# Altium schematic sheet A7_MGT.SchDoc
size A3
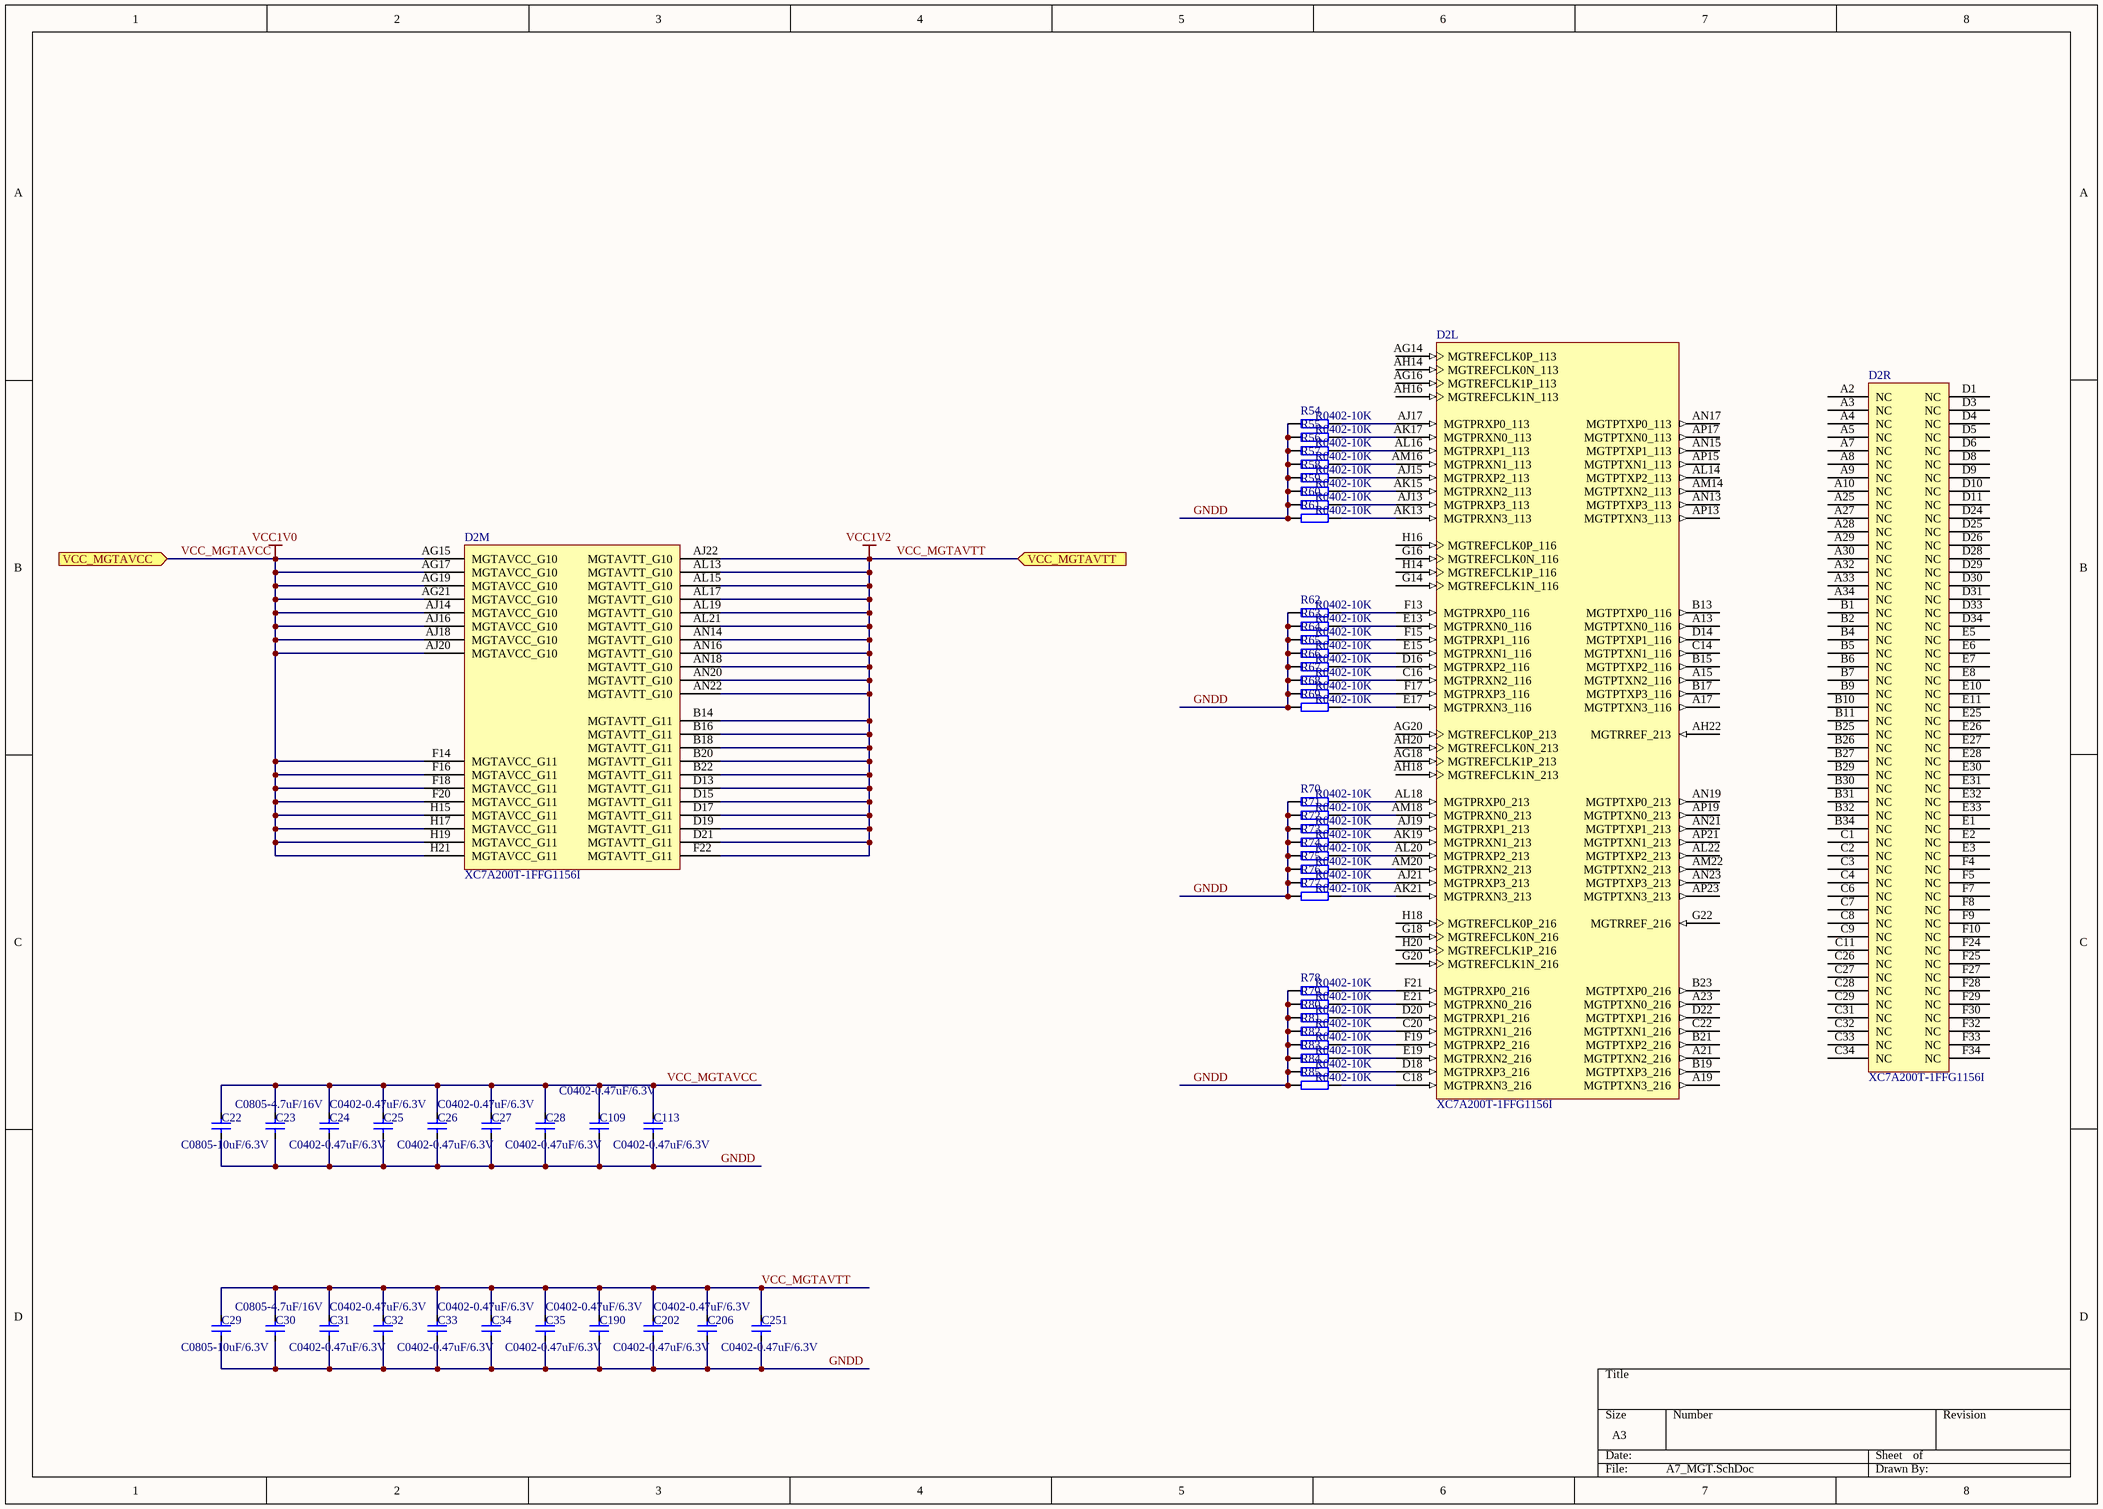
[diagram p0: A7_MGT.SchDoc]

## Parts
C22  C0805-10uF/6.3V  [C0805]
C23  C0805-4.7uF/16V  [C0805]
C24  C0402-0.47uF/6.3V  [C0402]
C25  C0402-0.47uF/6.3V  [C0402]
C26  C0402-0.47uF/6.3V  [C0402]
C27  C0402-0.47uF/6.3V  [C0402]
C28  C0402-0.47uF/6.3V  [C0402]
C29  C0805-10uF/6.3V  [C0805]
C30  C0805-4.7uF/16V  [C0805]
C31  C0402-0.47uF/6.3V  [C0402]
C32  C0402-0.47uF/6.3V  [C0402]
C33  C0402-0.47uF/6.3V  [C0402]
C34  C0402-0.47uF/6.3V  [C0402]
C35  C0402-0.47uF/6.3V  [C0402]
C109  C0402-0.47uF/6.3V  [C0402]
C113  C0402-0.47uF/6.3V  [C0402]
C190  C0402-0.47uF/6.3V  [C0402]
C202  C0402-0.47uF/6.3V  [C0402]
C206  C0402-0.47uF/6.3V  [C0402]
C251  C0402-0.47uF/6.3V  [C0402]
D2  XC7A200T-1FFG1156I  [FFG1156]  (parts L,M,R of 18)
R54  R0402-10K  [R0402]
R55  R0402-10K  [R0402]
R56  R0402-10K  [R0402]
R57  R0402-10K  [R0402]
R58  R0402-10K  [R0402]
R59  R0402-10K  [R0402]
R60  R0402-10K  [R0402]
R61  R0402-10K  [R0402]
R62  R0402-10K  [R0402]
R63  R0402-10K  [R0402]
R64  R0402-10K  [R0402]
R65  R0402-10K  [R0402]
R66  R0402-10K  [R0402]
R67  R0402-10K  [R0402]
R68  R0402-10K  [R0402]
R69  R0402-10K  [R0402]
R70  R0402-10K  [R0402]
R71  R0402-10K  [R0402]
R72  R0402-10K  [R0402]
R73  R0402-10K  [R0402]
R74  R0402-10K  [R0402]
R75  R0402-10K  [R0402]
R76  R0402-10K  [R0402]
R77  R0402-10K  [R0402]
R78  R0402-10K  [R0402]
R79  R0402-10K  [R0402]
R80  R0402-10K  [R0402]
R81  R0402-10K  [R0402]
R82  R0402-10K  [R0402]
R83  R0402-10K  [R0402]
R84  R0402-10K  [R0402]
R85  R0402-10K  [R0402]

## Ports
VCC_MGTAVCC (in), VCC_MGTAVTT (in)

## Nets
VCC_MGTAVCC: C22.1 C23.1 C24.1 C25.1 C26.1 C27.1 C28.1 C109.1 C113.1 D2.AG15(MGTAVCC_G10) D2.AG17(MGTAVCC_G10) D2.AG19(MGTAVCC_G10) D2.AG21(MGTAVCC_G10) D2.AJ14(MGTAVCC_G10) D2.AJ16(MGTAVCC_G10) D2.AJ18(MGTAVCC_G10) D2.AJ20(MGTAVCC_G10) D2.F14(MGTAVCC_G11) D2.F16(MGTAVCC_G11) D2.F18(MGTAVCC_G11) D2.F20(MGTAVCC_G11) D2.H15(MGTAVCC_G11) D2.H17(MGTAVCC_G11) D2.H19(MGTAVCC_G11) D2.H21(MGTAVCC_G11) ; port VCC_MGTAVCC  [also labelled VCC1V0]
VCC_MGTAVTT: C29.1 C30.1 C31.1 C32.1 C33.1 C34.1 C35.1 C190.1 C202.1 C206.1 C251.1 D2.AJ22(MGTAVTT_G10) D2.AL13(MGTAVTT_G10) D2.AL15(MGTAVTT_G10) D2.AL17(MGTAVTT_G10) D2.AL19(MGTAVTT_G10) D2.AL21(MGTAVTT_G10) D2.AN14(MGTAVTT_G10) D2.AN16(MGTAVTT_G10) D2.AN18(MGTAVTT_G10) D2.AN20(MGTAVTT_G10) D2.AN22(MGTAVTT_G10) D2.B14(MGTAVTT_G11) D2.B16(MGTAVTT_G11) D2.B18(MGTAVTT_G11) D2.B20(MGTAVTT_G11) D2.B22(MGTAVTT_G11) D2.D13(MGTAVTT_G11) D2.D15(MGTAVTT_G11) D2.D17(MGTAVTT_G11) D2.D19(MGTAVTT_G11) D2.D21(MGTAVTT_G11) D2.F22(MGTAVTT_G11) ; port VCC_MGTAVTT  [also labelled VCC1V2]
GNDD: C22.2 C23.2 C24.2 C25.2 C26.2 C27.2 C28.2 C29.2 C30.2 C31.2 C32.2 C33.2 C34.2 C35.2 C109.2 C113.2 C190.2 C202.2 C206.2 C251.2 R54.1 R55.1 R56.1 R57.1 R58.1 R59.1 R60.1 R61.1 R62.1 R63.1 R64.1 R65.1 R66.1 R67.1 R68.1 R69.1 R70.1 R71.1 R72.1 R73.1 R74.1 R75.1 R76.1 R77.1 R78.1 R79.1 R80.1 R81.1 R82.1 R83.1 R84.1 R85.1
NetD2_AJ13: D2.AJ13(MGTPRXP3_113) R60.2
NetD2_AJ15: D2.AJ15(MGTPRXP2_113) R58.2
NetD2_AJ17: D2.AJ17(MGTPRXP0_113) R54.2
NetD2_AJ19: D2.AJ19(MGTPRXP1_213) R72.2
NetD2_AJ21: D2.AJ21(MGTPRXP3_213) R76.2
NetD2_AK13: D2.AK13(MGTPRXN3_113) R61.2
NetD2_AK15: D2.AK15(MGTPRXN2_113) R59.2
NetD2_AK17: D2.AK17(MGTPRXN0_113) R55.2
NetD2_AK19: D2.AK19(MGTPRXN1_213) R73.2
NetD2_AK21: D2.AK21(MGTPRXN3_213) R77.2
NetD2_AL16: D2.AL16(MGTPRXP1_113) R56.2
NetD2_AL18: D2.AL18(MGTPRXP0_213) R70.2
NetD2_AL20: D2.AL20(MGTPRXP2_213) R74.2
NetD2_AM16: D2.AM16(MGTPRXN1_113) R57.2
NetD2_AM18: D2.AM18(MGTPRXN0_213) R71.2
NetD2_AM20: D2.AM20(MGTPRXN2_213) R75.2
NetD2_C16: D2.C16(MGTPRXN2_116) R67.2
NetD2_C18: D2.C18(MGTPRXN3_216) R85.2
NetD2_C20: D2.C20(MGTPRXN1_216) R81.2
NetD2_D16: D2.D16(MGTPRXP2_116) R66.2
NetD2_D18: D2.D18(MGTPRXP3_216) R84.2
NetD2_D20: D2.D20(MGTPRXP1_216) R80.2
NetD2_E13: D2.E13(MGTPRXN0_116) R63.2
NetD2_E15: D2.E15(MGTPRXN1_116) R65.2
NetD2_E17: D2.E17(MGTPRXN3_116) R69.2
NetD2_E19: D2.E19(MGTPRXN2_216) R83.2
NetD2_E21: D2.E21(MGTPRXN0_216) R79.2
NetD2_F13: D2.F13(MGTPRXP0_116) R62.2
NetD2_F15: D2.F15(MGTPRXP1_116) R64.2
NetD2_F17: D2.F17(MGTPRXP3_116) R68.2
NetD2_F19: D2.F19(MGTPRXP2_216) R82.2
NetD2_F21: D2.F21(MGTPRXP0_216) R78.2

Not connected (* = marked no-connect by the designer): D2 A2(NC) A3(NC) A4(NC) A5(NC) A7(NC) A8(NC) A9(NC) A10(NC) A13(MGTPTXN0_116) A15(MGTPTXN2_116) A17(MGTPTXN3_116) A19(MGTPTXN3_216) A21(MGTPTXN2_216) A23(MGTPTXN0_216) A25(NC) A27(NC) A28(NC) A29(NC) A30(NC) A32(NC) A33(NC) A34(NC) AG14(MGTREFCLK0P_113) AG16(MGTREFCLK1P_113) AG18(MGTREFCLK1P_213) AG20(MGTREFCLK0P_213) AH14(MGTREFCLK0N_113) AH16(MGTREFCLK1N_113) AH18(MGTREFCLK1N_213) AH20(MGTREFCLK0N_213) AH22(MGTRREF_213) AL14(MGTPTXP2_113) AL22(MGTPTXP2_213) AM14(MGTPTXN2_113) AM22(MGTPTXN2_213) AN13(MGTPTXP3_113) AN15(MGTPTXP1_113) AN17(MGTPTXP0_113) AN19(MGTPTXP0_213) AN21(MGTPTXP1_213) AN23(MGTPTXP3_213) AP13(MGTPTXN3_113) AP15(MGTPTXN1_113) AP17(MGTPTXN0_113) AP19(MGTPTXN0_213) AP21(MGTPTXN1_213) AP23(MGTPTXN3_213) B1(NC) B2(NC) B4(NC) B5(NC) B6(NC) B7(NC) B9(NC) B10(NC) B11(NC) B13(MGTPTXP0_116) B15(MGTPTXP2_116) B17(MGTPTXP3_116) B19(MGTPTXP3_216) B21(MGTPTXP2_216) B23(MGTPTXP0_216) B25(NC) B26(NC) B27(NC) B29(NC) B30(NC) B31(NC) B32(NC) B34(NC) C1(NC) C2(NC) C3(NC) C4(NC) C6(NC) C7(NC) C8(NC) C9(NC) C11(NC) C14(MGTPTXN1_116) C22(MGTPTXN1_216) C26(NC) C27(NC) C28(NC) C29(NC) C31(NC) C32(NC) C33(NC) C34(NC) D1(NC) D3(NC) D4(NC) D5(NC) D6(NC) D8(NC) D9(NC) D10(NC) D11(NC) D14(MGTPTXP1_116) D22(MGTPTXP1_216) D24(NC) D25(NC) D26(NC) D28(NC) D29(NC) D30(NC) D31(NC) D33(NC) D34(NC) E1(NC) E2(NC) E3(NC) E5(NC) E6(NC) E7(NC) E8(NC) E10(NC) E11(NC) E25(NC) E26(NC) E27(NC) E28(NC) E30(NC) E31(NC) E32(NC) E33(NC) F4(NC) F5(NC) F7(NC) F8(NC) F9(NC) F10(NC) F24(NC) F25(NC) F27(NC) F28(NC) F29(NC) F30(NC) F32(NC) F33(NC) F34(NC) G14(MGTREFCLK1N_116) G16(MGTREFCLK0N_116) G18(MGTREFCLK0N_216) G20(MGTREFCLK1N_216) G22(MGTRREF_216) H14(MGTREFCLK1P_116) H16(MGTREFCLK0P_116) H18(MGTREFCLK0P_216) H20(MGTREFCLK1P_216)

## Library data of the parts
C22 C29 = C1210-22uF/16V: Part_number: C0805-10uF/6.3V; Part_type: CAP; Value: C0805-10uF/6.3V; Schematic_Part: CAP; PCB_Footprint: C0805
C23 C30 = C0805-4.7uF/50V: X7R; Manufacturer: SAMSUNG; Part_number: C0805-4.7uF/16V; Part_type: CAP; Value: C0805-4.7uF/16V; Schematic_Part: CAP; PCB_Footprint: C0805; datasheet: #DataSheet\C_Samsung_General Capacitors.pdf#
C24-C28 C31-C35 C109 C113 C190 C202 C206 C251 = C0402-0.1uF/16V: X7R; Manufacturer: SAMSUNG; Manufacturer_p/n: CL05X7R104KO5NNN; Part_number: C0402-0.47uF/6.3V; Part_type: CAP; Value: C0402-0.47uF/6.3V; temperature: -55℃\+125℃; Schematic_Part: CAP; PCB_Footprint: C0402; datasheet: #DataSheet\C_Samsung_General Capacitors.pdf#
D2 = XC7A200T-1FFG1156I: Artix-7 FPGA, 500 User I/Os, 16 GTP, 1156-Ball BGA, Speed Grade 1, Industrial Grade, Pb-Free; Manufacturer: Xilinx; Block RAM Blocks (18Kb): 730; Block RAM Blocks (36Kb): 365; Block RAM Blocks (Max Kb): 13140; CLBs (Slices): 33650; Clock Mgmt Tiles (CMTs): 10; DSP48E1 Slices: 740; Logic Cells: 215360; Max User I/O: 500; Speed Grade: -1; DatasheetVersion: v1.12; PackageVersion: Rev 1.8; PackageReference: FFG1156; PackageDescription: Flip-Chip BGA, Body 35 x 35 mm, 1.0 mm Pitch; CLBs (Max Distributed RAM Kb): 2888; Generic Part Number: XC7A200T; RoHS: Pb-Free; Mounting Technology: Surface Mount; Code_JEDEC: MS-034-AAR-1; PartNumber: XC7A200T-1FFG1156I; ComponentLink1Description: Datasheet; ComponentLink1URL: http://www.xilinx.com/support/documentation/data_sheets/ds180_7Series_Overview.pdf; ComponentLink2Description: Package Specification; ComponentLink2URL: http://www.xilinx.com/support/documentation/user_guides/ug475_7Series_Pkg_Pinout.pdf; ComponentLink3Description: DC and Switching Characteristics; ComponentLink3URL: http://www.xilinx.com/support/documentation/data_sheets/ds181_Artix_7_Data_Sheet.pdf; ComponentLink4Description: Package File; ComponentLink4URL: http://www.xilinx.com/support/packagefiles/a7packages/xc7a200tfbg676pkg.txt; ComponentLink5Description: Packaging and Pinout; ComponentLink5URL: http://www.xilinx.com/support/documentation/user_guides/ug475_7Series_Pkg_Pinout.pdf
R54-R85 = R0402-10K: Manufacturer: SAMSUNG; Part_number: R0402-10K; Part_type: RES; Value: R0402-10K; Schematic_Part: RES; PCB_Footprint: R0402